# Altium project BoatSensor.PrjPcb
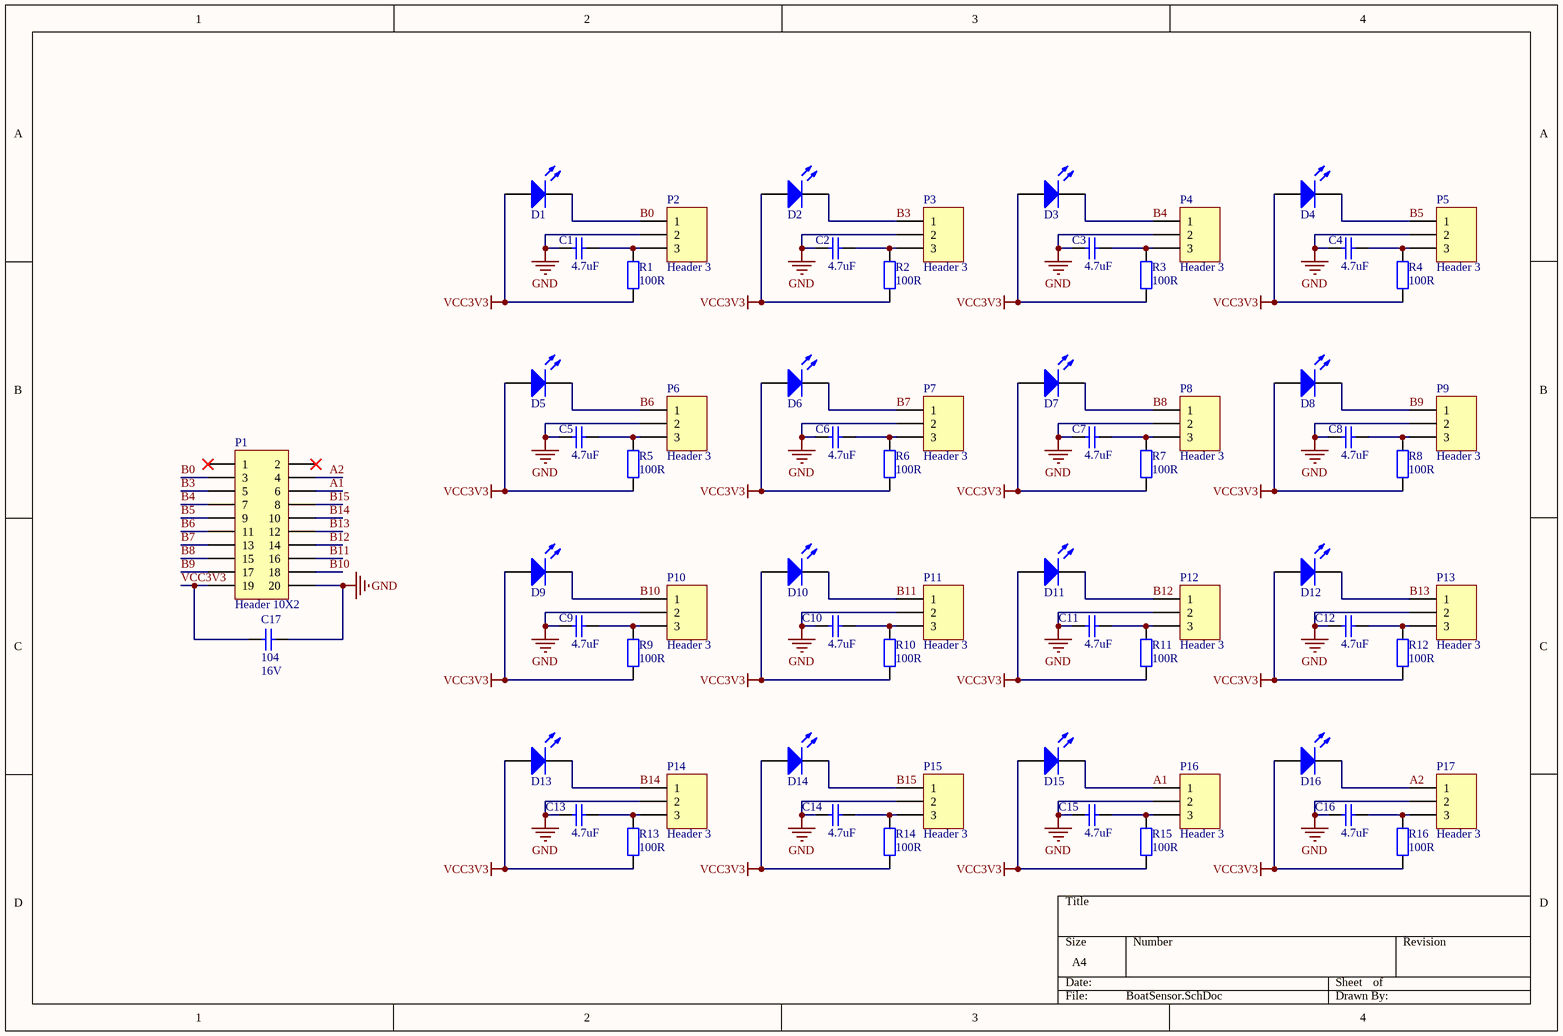
[diagram p0: BoatSensor.SchDoc]
1 sheet, 66 parts. Net scope: global (net labels, ports and power ports of the same name join across sheets).
Board file: BoatSensor.PcbDoc

## Sheet BoatSensor.SchDoc
size A4

### Parts
C1  value 4.7uF  [0805]  (hidden comment: Cap_2)
C2  value 4.7uF  [0805]  (hidden comment: Cap_2)
C3  value 4.7uF  [0805]  (hidden comment: Cap_2)
C4  value 4.7uF  [0805]  (hidden comment: Cap_2)
C5  value 4.7uF  [0805]  (hidden comment: Cap_2)
C6  value 4.7uF  [0805]  (hidden comment: Cap_2)
C7  value 4.7uF  [0805]  (hidden comment: Cap_2)
C8  value 4.7uF  [0805]  (hidden comment: Cap_2)
C9  value 4.7uF  [0805]  (hidden comment: Cap_2)
C10  value 4.7uF  [0805]  (hidden comment: Cap_2)
C11  value 4.7uF  [0805]  (hidden comment: Cap_2)
C12  value 4.7uF  [0805]  (hidden comment: Cap_2)
C13  value 4.7uF  [0805]  (hidden comment: Cap_2)
C14  value 4.7uF  [0805]  (hidden comment: Cap_2)
C15  value 4.7uF  [0805]  (hidden comment: Cap_2)
C16  value 4.7uF  [0805]  (hidden comment: Cap_2)
C17  value 104  Pressure Voltage: 16V  [0805]  (hidden comment: Cap)
D1  LED  [LED_0805]  (value not drawn)
D2  LED  [LED_0805]  (value not drawn)
D3  LED  [LED_0805]  (value not drawn)
D4  LED  [LED_0805]  (value not drawn)
D5  LED  [LED_0805]  (value not drawn)
D6  LED  [LED_0805]  (value not drawn)
D7  LED  [LED_0805]  (value not drawn)
D8  LED  [LED_0805]  (value not drawn)
D9  LED  [LED_0805]  (value not drawn)
D10  LED  [LED_0805]  (value not drawn)
D11  LED  [LED_0805]  (value not drawn)
D12  LED  [LED_0805]  (value not drawn)
D13  LED  [LED_0805]  (value not drawn)
D14  LED  [LED_0805]  (value not drawn)
D15  LED  [LED_0805]  (value not drawn)
D16  LED  [LED_0805]  (value not drawn)
P1  Header 10X2  [HDR2X10]
P2  Header 3  [HDR1X3]
P3  Header 3  [HDR1X3]
P4  Header 3  [HDR1X3]
P5  Header 3  [HDR1X3]
P6  Header 3  [HDR1X3]
P7  Header 3  [HDR1X3]
P8  Header 3  [HDR1X3]
P9  Header 3  [HDR1X3]
P10  Header 3  [HDR1X3]
P11  Header 3  [HDR1X3]
P12  Header 3  [HDR1X3]
P13  Header 3  [HDR1X3]
P14  Header 3  [HDR1X3]
P15  Header 3  [HDR1X3]
P16  Header 3  [HDR1X3]
P17  Header 3  [HDR1X3]
R1  value 100R  [0805]  (hidden comment: Res_)
R2  value 100R  [0805]  (hidden comment: Res_)
R3  value 100R  [0805]  (hidden comment: Res_)
R4  value 100R  [0805]  (hidden comment: Res_)
R5  value 100R  [0805]  (hidden comment: Res_)
R6  value 100R  [0805]  (hidden comment: Res_)
R7  value 100R  [0805]  (hidden comment: Res_)
R8  value 100R  [0805]  (hidden comment: Res_)
R9  value 100R  [0805]  (hidden comment: Res_)
R10  value 100R  [0805]  (hidden comment: Res_)
R11  value 100R  [0805]  (hidden comment: Res_)
R12  value 100R  [0805]  (hidden comment: Res_)
R13  value 100R  [0805]  (hidden comment: Res_)
R14  value 100R  [0805]  (hidden comment: Res_)
R15  value 100R  [0805]  (hidden comment: Res_)
R16  value 100R  [0805]  (hidden comment: Res_)

### Nets
GND: C1.2 C2.2 C3.2 C4.2 C5.2 C6.2 C7.2 C8.2 C9.2 C10.2 C11.2 C12.2 C13.2 C14.2 C15.2 C16.2 C17.2 P1.20 P2.2 P3.2 P4.2 P5.2 P6.2 P7.2 P8.2 P9.2 P10.2 P11.2 P12.2 P13.2 P14.2 P15.2 P16.2 P17.2
VCC3V3: C17.1 D1.1(A) D2.1(A) D3.1(A) D4.1(A) D5.1(A) D6.1(A) D7.1(A) D8.1(A) D9.1(A) D10.1(A) D11.1(A) D12.1(A) D13.1(A) D14.1(A) D15.1(A) D16.1(A) P1.19 R1.2 R2.2 R3.2 R4.2 R5.2 R6.2 R7.2 R8.2 R9.2 R10.2 R11.2 R12.2 R13.2 R14.2 R15.2 R16.2
A1: D15.2(K) P1.6 P16.1
A2: D16.2(K) P1.4 P17.1
B0: D1.2(K) P1.3 P2.1
B3: D2.2(K) P1.5 P3.1
B4: D3.2(K) P1.7 P4.1
B5: D4.2(K) P1.9 P5.1
B6: D5.2(K) P1.11 P6.1
B7: D6.2(K) P1.13 P7.1
B8: D7.2(K) P1.15 P8.1
B9: D8.2(K) P1.17 P9.1
B10: D9.2(K) P1.18 P10.1
B11: D10.2(K) P1.16 P11.1
B12: D11.2(K) P1.14 P12.1
B13: D12.2(K) P1.12 P13.1
B14: D13.2(K) P1.10 P14.1
B15: D14.2(K) P1.8 P15.1
NetC1_1: C1.1 P2.3 R1.1
NetC2_1: C2.1 P3.3 R2.1
NetC3_1: C3.1 P4.3 R3.1
NetC4_1: C4.1 P5.3 R4.1
NetC5_1: C5.1 P6.3 R5.1
NetC6_1: C6.1 P7.3 R6.1
NetC7_1: C7.1 P8.3 R7.1
NetC8_1: C8.1 P9.3 R8.1
NetC9_1: C9.1 P10.3 R9.1
NetC10_1: C10.1 P11.3 R10.1
NetC11_1: C11.1 P12.3 R11.1
NetC12_1: C12.1 P13.3 R12.1
NetC13_1: C13.1 P14.3 R13.1
NetC14_1: C14.1 P15.3 R14.1
NetC15_1: C15.1 P16.3 R15.1
NetC16_1: C16.1 P17.3 R16.1

Not connected (* = marked no-connect by the designer): P1 1* 2*

### Library data of the parts
C17 = Cap: 原理图绘制者: 刘永钦; 原理图何处使用过: 2014年飞思卡尔底板; 原理图审核人1: 徐鹏飞; 封装0805何处使用: 2015年航行器遥控器; 原理图审核人2: 朱觉文; 封装0603何处使用过: 在2401转接板上使用; 原理图提供者: 刘永钦; 封装0805绘制者: 刘永钦; 封装0805提供者: 刘永钦; 封装0805审核人1: 徐鹏飞; 封装0805审核人2: 朱觉文; 封装0603绘制者: 刘永钦; 封装0603提供者: 刘永钦; 封装0603审核人1: 朱觉文; 封装0603审核人2: 徐鹏飞
D1-D16 = LED: 原理图绘制者: 刘永钦; 原理图何处使用过: 2014年飞思卡尔底板; 原理图审核人1: 徐鹏飞; Color: 蓝色; 封装1210LED何处使用过: 2014年的一个小板子; 封装LED_3mm何处使用过: 2014年变频器面板; 封装LED_0805使用过: 2015年飞思卡尔底板; 原理图审核人2: 朱觉文; 封装LED0603何处使用过: 2401转接板; 原理图提供者: 刘永钦; 封装1210LED绘制者: 刘永钦; 封装1210LED提供者: 刘永钦; 封装1210LED审核人1: 徐鹏飞; 封装LED_3mm绘制者: 刘永钦; 封装LED_3mm提供者: 刘永钦; 封装LED_0805绘制者: 刘永钦; 封装LED_0805提供者: 刘永钦; 封装LED_0805审核人1: 徐鹏飞; 封装1210LED审核人2: 朱觉文; 封装LED_0805审核人2: 朱觉文; 封装LED_3mm审核者2: 朱觉文; 封装LED0603绘制者: 刘永钦; 封装LED0603审核人2: 朱觉文; 封装LED0603提供者: 刘永钦; 封装LED0603审核人1: 徐鹏飞
P1 = Header 10X2: Header, 10-Pin, Dual row; LatestRevisionDate: 17-Jul-2002; LatestRevisionNote: Re-released for DXP Platform.; Publisher: Altium Limited
P2-P17 = Header 3: Header, 3-Pin; LatestRevisionDate: 17-Jul-2002; LatestRevisionNote: Re-released for DXP Platform.; Publisher: Altium Limited